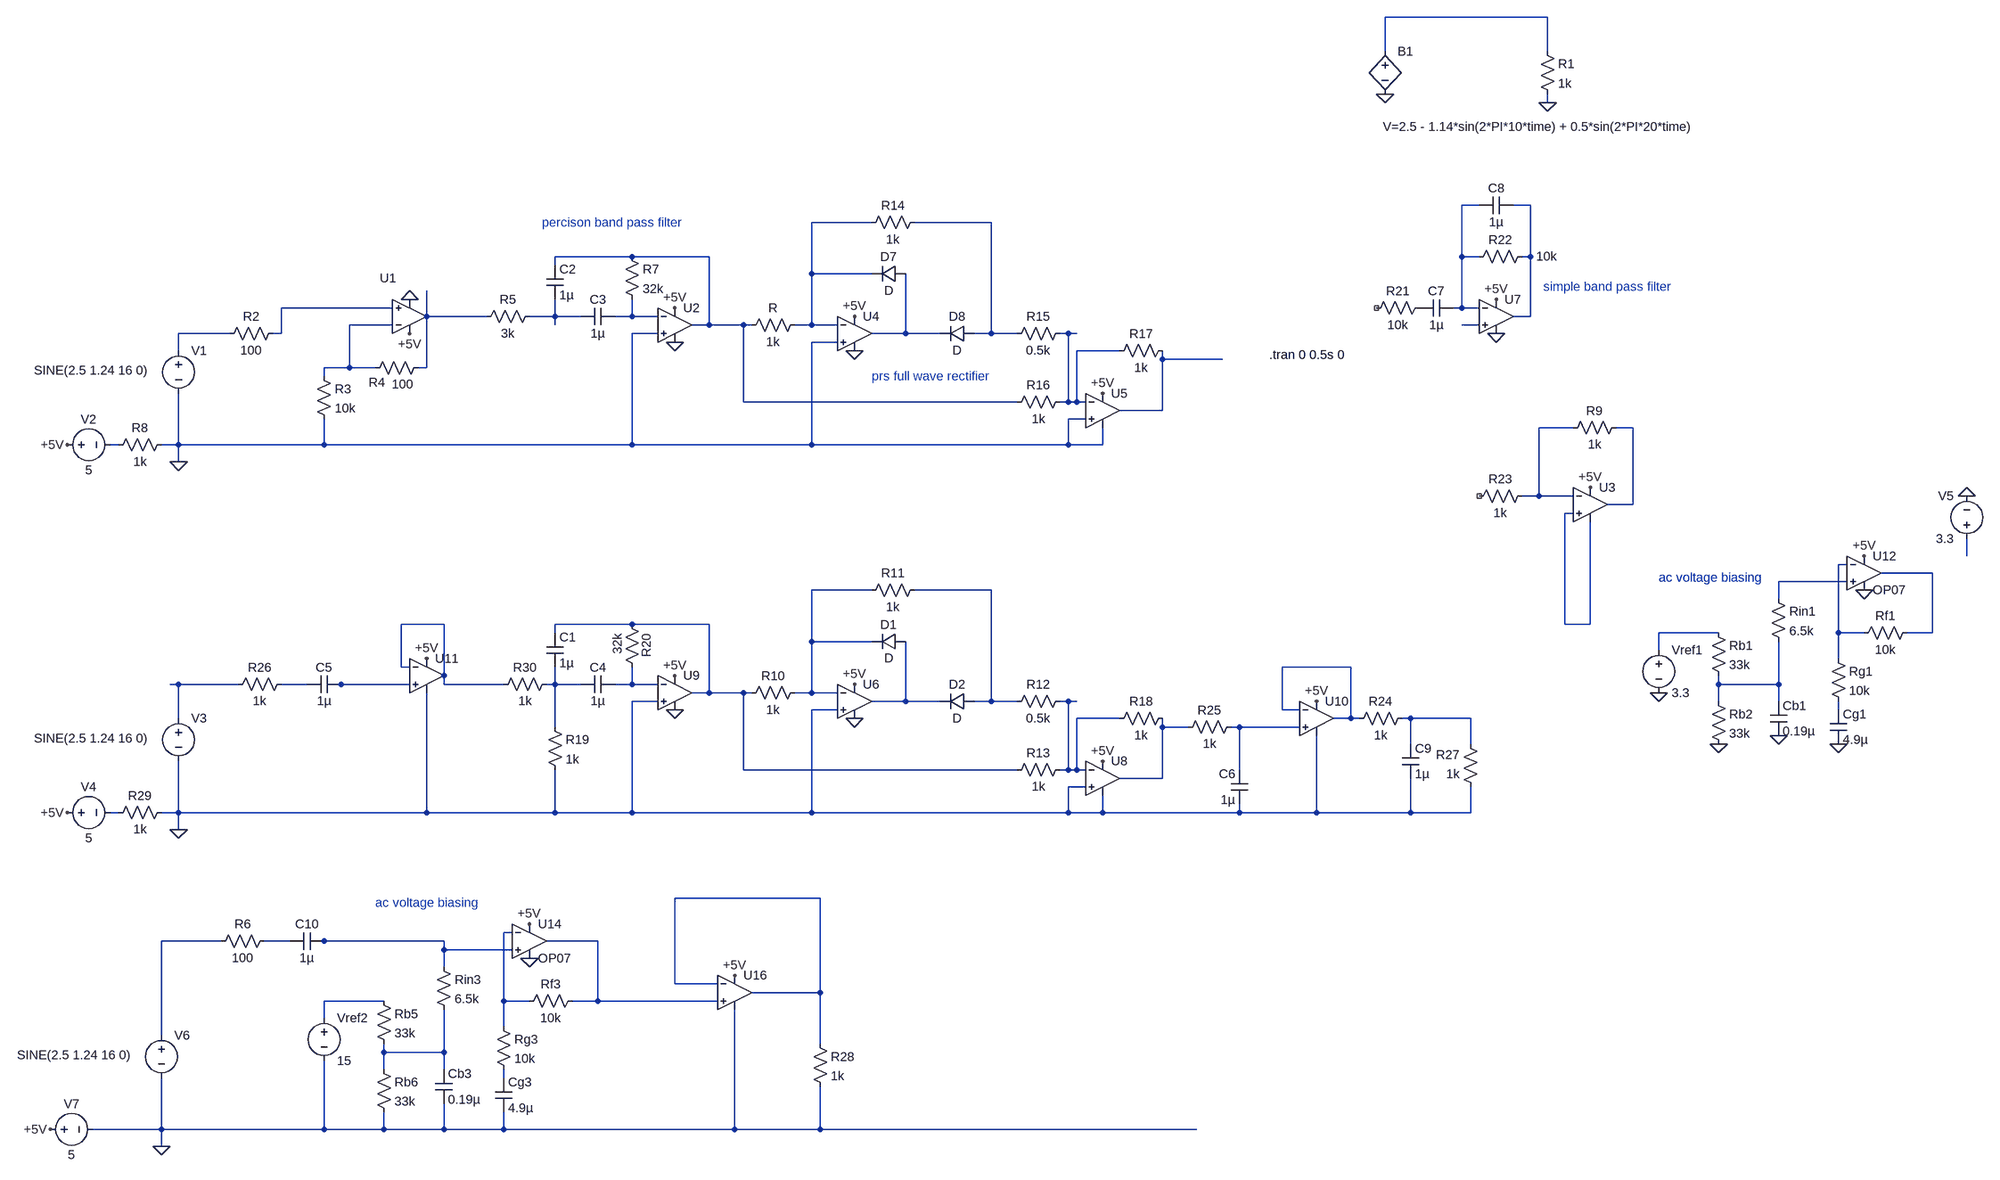
[diagram p0: schematic CO signal multiple systems.asc]
CO signal multiple systems.asc, the LTspice schematic file:
Version 4.1
SHEET 1 2020 3200
WIRE 1200 912 896 912
WIRE 896 976 896 912
WIRE 1200 976 1200 912
WIRE 1200 1072 1200 1056
WIRE 1072 1264 1040 1264
WIRE 1168 1264 1136 1264
WIRE -64 1296 -176 1296
WIRE 160 1296 16 1296
WIRE -512 1360 -656 1360
WIRE -368 1360 -512 1360
WIRE 1040 1360 1040 1264
WIRE 1072 1360 1040 1360
WIRE 1168 1360 1168 1264
WIRE 1168 1360 1152 1360
WIRE -656 1376 -656 1360
WIRE -176 1392 -176 1296
WIRE -64 1392 -176 1392
WIRE -960 1456 -1168 1456
WIRE 1040 1456 1040 1360
WIRE 1040 1456 1024 1456
WIRE 1072 1456 1040 1456
WIRE -896 1472 -896 1424
WIRE -784 1472 -896 1472
WIRE -656 1472 -656 1440
WIRE -656 1472 -704 1472
WIRE -608 1472 -656 1472
WIRE -512 1472 -512 1440
WIRE -512 1472 -544 1472
WIRE -464 1472 -512 1472
WIRE 1168 1472 1168 1360
WIRE 1168 1472 1136 1472
WIRE -960 1488 -1040 1488
WIRE -656 1488 -656 1472
WIRE -368 1488 -368 1360
WIRE -368 1488 -400 1488
WIRE -304 1488 -368 1488
WIRE -288 1488 -304 1488
WIRE -176 1488 -176 1392
WIRE -176 1488 -208 1488
WIRE -128 1488 -176 1488
WIRE 1072 1488 1040 1488
WIRE -1264 1504 -1360 1504
WIRE -1168 1504 -1168 1456
WIRE -1168 1504 -1184 1504
WIRE -464 1504 -512 1504
WIRE 0 1504 0 1392
WIRE 0 1504 -64 1504
WIRE 64 1504 0 1504
WIRE 160 1504 160 1296
WIRE 160 1504 128 1504
WIRE 208 1504 160 1504
WIRE 304 1504 288 1504
WIRE 320 1504 304 1504
WIRE -128 1520 -176 1520
WIRE -1360 1536 -1360 1504
WIRE 400 1536 320 1536
WIRE 480 1552 480 1536
WIRE 592 1552 480 1552
WIRE -1040 1568 -1040 1488
WIRE -1040 1568 -1088 1568
WIRE -992 1568 -1040 1568
WIRE -896 1568 -896 1472
WIRE -896 1568 -912 1568
WIRE -1088 1584 -1088 1568
WIRE -304 1632 -304 1488
WIRE 208 1632 -304 1632
WIRE 304 1632 304 1504
WIRE 304 1632 288 1632
WIRE 320 1632 320 1536
WIRE 320 1632 304 1632
WIRE 336 1632 320 1632
WIRE 480 1648 480 1552
WIRE 480 1648 400 1648
WIRE 336 1664 304 1664
WIRE 1248 1680 1184 1680
WIRE 1360 1680 1328 1680
WIRE -1472 1712 -1488 1712
WIRE -1360 1712 -1360 1616
WIRE -1360 1712 -1392 1712
WIRE -1088 1712 -1088 1664
WIRE -1088 1712 -1360 1712
WIRE -512 1712 -512 1504
WIRE -512 1712 -1088 1712
WIRE -176 1712 -176 1520
WIRE -176 1712 -512 1712
WIRE 304 1712 304 1664
WIRE 304 1712 -176 1712
WIRE 368 1712 368 1680
WIRE 368 1712 304 1712
WIRE -1360 1744 -1360 1712
WIRE 1184 1808 1184 1680
WIRE 1184 1808 1152 1808
WIRE 1248 1808 1184 1808
WIRE 1360 1824 1360 1680
WIRE 1360 1824 1312 1824
WIRE 1248 1840 1232 1840
WIRE 1984 1920 1984 1888
WIRE 1760 1936 1744 1936
WIRE 1920 1952 1824 1952
WIRE 1760 1968 1632 1968
WIRE -64 1984 -176 1984
WIRE 160 1984 16 1984
WIRE 1632 2000 1632 1968
WIRE -864 2048 -944 2048
WIRE -512 2048 -656 2048
WIRE -368 2048 -512 2048
WIRE 1232 2048 1232 1840
WIRE 1280 2048 1280 1856
WIRE 1280 2048 1232 2048
WIRE -656 2064 -656 2048
WIRE 1520 2064 1408 2064
WIRE 1744 2064 1744 1936
WIRE 1792 2064 1744 2064
WIRE 1920 2064 1920 1952
WIRE 1920 2064 1872 2064
WIRE -176 2080 -176 1984
WIRE -64 2080 -176 2080
WIRE 1408 2096 1408 2064
WIRE 1744 2112 1744 2064
WIRE -944 2128 -944 2048
WIRE -928 2128 -944 2128
WIRE 832 2128 704 2128
WIRE -864 2144 -864 2048
WIRE -1360 2160 -1376 2160
WIRE -1248 2160 -1360 2160
WIRE -1120 2160 -1168 2160
WIRE -1056 2160 -1072 2160
WIRE -928 2160 -1056 2160
WIRE -864 2160 -864 2144
WIRE -752 2160 -864 2160
WIRE -656 2160 -656 2128
WIRE -656 2160 -672 2160
WIRE -608 2160 -656 2160
WIRE -512 2160 -512 2128
WIRE -512 2160 -544 2160
WIRE -464 2160 -512 2160
WIRE 1520 2160 1520 2144
WIRE 1632 2160 1632 2080
WIRE 1632 2160 1520 2160
WIRE -368 2176 -368 2048
WIRE -368 2176 -400 2176
WIRE -304 2176 -368 2176
WIRE -288 2176 -304 2176
WIRE -176 2176 -176 2080
WIRE -176 2176 -208 2176
WIRE -128 2176 -176 2176
WIRE -464 2192 -512 2192
WIRE 0 2192 0 2080
WIRE 0 2192 -64 2192
WIRE 64 2192 0 2192
WIRE 160 2192 160 1984
WIRE 160 2192 128 2192
WIRE 208 2192 160 2192
WIRE 304 2192 288 2192
WIRE 320 2192 304 2192
WIRE 1520 2192 1520 2160
WIRE 1632 2192 1632 2160
WIRE -128 2208 -176 2208
WIRE 704 2208 704 2128
WIRE 736 2208 704 2208
WIRE 1744 2208 1744 2192
WIRE -1360 2224 -1360 2160
WIRE 400 2224 320 2224
WIRE 832 2224 832 2128
WIRE 832 2224 800 2224
WIRE 848 2224 832 2224
WIRE 944 2224 928 2224
WIRE 1056 2224 944 2224
WIRE -656 2240 -656 2160
WIRE 480 2240 480 2224
WIRE 528 2240 480 2240
WIRE 624 2240 608 2240
WIRE 736 2240 624 2240
WIRE 944 2272 944 2224
WIRE 1056 2272 1056 2224
WIRE -304 2320 -304 2176
WIRE 208 2320 -304 2320
WIRE 304 2320 304 2192
WIRE 304 2320 288 2320
WIRE 320 2320 320 2224
WIRE 320 2320 304 2320
WIRE 336 2320 320 2320
WIRE 624 2320 624 2240
WIRE 480 2336 480 2240
WIRE 480 2336 400 2336
WIRE 336 2352 304 2352
WIRE -1472 2400 -1488 2400
WIRE -1360 2400 -1360 2304
WIRE -1360 2400 -1392 2400
WIRE -896 2400 -896 2176
WIRE -896 2400 -1360 2400
WIRE -656 2400 -656 2320
WIRE -656 2400 -896 2400
WIRE -512 2400 -512 2192
WIRE -512 2400 -656 2400
WIRE -176 2400 -176 2208
WIRE -176 2400 -512 2400
WIRE 304 2400 304 2352
WIRE 304 2400 -176 2400
WIRE 368 2400 368 2368
WIRE 368 2400 304 2400
WIRE 624 2400 624 2384
WIRE 624 2400 368 2400
WIRE 768 2400 768 2256
WIRE 768 2400 624 2400
WIRE 944 2400 944 2336
WIRE 944 2400 768 2400
WIRE 1056 2400 1056 2352
WIRE 1056 2400 944 2400
WIRE -1360 2432 -1360 2400
WIRE -160 2704 -432 2704
WIRE -736 2768 -752 2768
WIRE -1280 2784 -1392 2784
WIRE -1152 2784 -1200 2784
WIRE -1088 2784 -1104 2784
WIRE -864 2784 -1088 2784
WIRE -576 2784 -672 2784
WIRE -864 2800 -864 2784
WIRE -736 2800 -864 2800
WIRE -864 2832 -864 2800
WIRE -432 2864 -432 2704
WIRE -352 2864 -432 2864
WIRE -160 2880 -160 2704
WIRE -160 2880 -288 2880
WIRE -976 2896 -1088 2896
WIRE -752 2896 -752 2768
WIRE -704 2896 -752 2896
WIRE -576 2896 -576 2784
WIRE -576 2896 -624 2896
WIRE -352 2896 -576 2896
WIRE -1088 2928 -1088 2896
WIRE -752 2944 -752 2896
WIRE -1392 2960 -1392 2784
WIRE -160 2976 -160 2880
WIRE -976 2992 -976 2976
WIRE -864 2992 -864 2912
WIRE -864 2992 -976 2992
WIRE -976 3024 -976 2992
WIRE -864 3024 -864 2992
WIRE -752 3040 -752 3024
WIRE -1392 3136 -1392 3040
WIRE -1392 3136 -1520 3136
WIRE -1088 3136 -1088 3008
WIRE -1088 3136 -1392 3136
WIRE -976 3136 -976 3104
WIRE -976 3136 -1088 3136
WIRE -864 3136 -864 3088
WIRE -864 3136 -976 3136
WIRE -752 3136 -752 3104
WIRE -752 3136 -864 3136
WIRE -320 3136 -320 2912
WIRE -320 3136 -752 3136
WIRE -160 3136 -160 3056
WIRE -160 3136 -320 3136
WIRE 544 3136 -160 3136
WIRE -1392 3168 -1392 3136
FLAG 1200 1072 0
FLAG 896 1056 0
FLAG -1360 1744 0
FLAG -1568 1712 +5V
FLAG -928 1504 +5V
FLAG -928 1440 0
FLAG 1104 1504 0
FLAG 1104 1440 +5V
FLAG -96 1472 +5V
FLAG -96 1536 0
FLAG 368 1616 +5V
FLAG -432 1456 +5V
FLAG -432 1520 0
FLAG -1360 2432 0
FLAG -1568 2400 +5V
FLAG -96 2160 +5V
FLAG -96 2224 0
FLAG 368 2304 +5V
FLAG -432 2144 +5V
FLAG -432 2208 0
FLAG 1280 1792 +5V
FLAG 768 2192 +5V
FLAG -896 2112 +5V
FLAG 1984 1808 0
FLAG -1392 3168 0
FLAG -1600 3136 +5V
FLAG 1792 1984 0
FLAG 1408 2176 0
FLAG 1520 2272 0
FLAG 1632 2256 0
FLAG 1744 2272 0
FLAG 1792 1920 +5V
FLAG -704 2816 0
FLAG -704 2752 +5V
FLAG -320 2848 +5V
SYMBOL bv 896 960 R0
WINDOW 3 -4 157 Left 2
SYMATTR Value V=2.5 - 1.14*sin(2*PI*10*time) + 0.5*sin(2*PI*20*time)
SYMATTR InstName B1
SYMBOL res 1184 960 R0
SYMATTR InstName R1
SYMATTR Value 1k
SYMBOL voltage -1360 1520 R0
WINDOW 3 -270 53 Left 2
WINDOW 123 0 0 Left 0
WINDOW 39 0 0 Left 0
SYMATTR Value SINE(2.5 1.24 16 0)
SYMATTR InstName V1
SYMBOL res -1168 1488 R90
WINDOW 0 0 56 VBottom 2
WINDOW 3 32 56 VTop 2
SYMATTR InstName R2
SYMATTR Value 100
SYMBOL res -1104 1568 R0
SYMATTR InstName R3
SYMATTR Value 10k
SYMBOL OpAmps\\UniversalOpAmp -928 1472 M180
WINDOW 0 -56 72 Left 2
SYMATTR InstName U1
SYMBOL voltage -1584 1712 R270
WINDOW 0 32 56 VTop 2
WINDOW 3 -32 56 VBottom 2
WINDOW 123 0 0 Left 0
WINDOW 39 0 0 Left 0
SYMATTR InstName V2
SYMATTR Value 5
SYMBOL res -896 1552 R90
WINDOW 0 59 93 VBottom 2
WINDOW 3 31 45 VTop 2
SYMATTR InstName R4
SYMATTR Value 100
SYMBOL res -192 1472 R90
WINDOW 0 0 56 VBottom 2
WINDOW 3 32 56 VTop 2
SYMATTR InstName R
SYMATTR Value 1k
SYMBOL OpAmps\\UniversalOpAmp -96 1504 R0
SYMATTR InstName U4
SYMBOL res 32 1280 R90
WINDOW 0 0 56 VBottom 2
WINDOW 3 32 56 VTop 2
SYMATTR InstName R14
SYMATTR Value 1k
SYMBOL diode 0 1376 R90
WINDOW 0 0 32 VBottom 2
WINDOW 3 32 32 VTop 2
SYMATTR InstName D7
SYMBOL diode 128 1488 R90
WINDOW 0 0 32 VBottom 2
WINDOW 3 32 32 VTop 2
SYMATTR InstName D8
SYMBOL res 304 1488 R90
WINDOW 0 0 56 VBottom 2
WINDOW 3 32 56 VTop 2
SYMATTR InstName R15
SYMATTR Value 0.5k
SYMBOL res 304 1616 R90
WINDOW 0 0 56 VBottom 2
WINDOW 3 32 56 VTop 2
SYMATTR InstName R16
SYMATTR Value 1k
SYMBOL OpAmps\\UniversalOpAmp 368 1648 R0
SYMATTR InstName U5
SYMBOL res 496 1520 R90
WINDOW 0 0 56 VBottom 2
WINDOW 3 32 56 VTop 2
SYMATTR InstName R17
SYMATTR Value 1k
SYMBOL res 976 1440 R90
WINDOW 0 0 56 VBottom 2
WINDOW 3 32 56 VTop 2
SYMATTR InstName R21
SYMATTR Value 10k
SYMBOL res 1168 1344 R90
WINDOW 0 0 56 VBottom 2
WINDOW 3 0 -30 VTop 2
SYMATTR InstName R22
SYMATTR Value 10k
SYMBOL cap 1024 1440 R90
WINDOW 0 0 32 VBottom 2
WINDOW 3 32 32 VTop 2
SYMATTR InstName C7
SYMATTR Value 1µ
SYMBOL cap 1136 1248 R90
WINDOW 0 0 32 VBottom 2
WINDOW 3 32 32 VTop 2
SYMATTR InstName C8
SYMATTR Value 1µ
SYMBOL OpAmps\\UniversalOpAmp 1104 1472 R0
SYMATTR InstName U7
SYMBOL res -688 1456 R90
WINDOW 0 0 56 VBottom 2
WINDOW 3 32 56 VTop 2
SYMATTR InstName R5
SYMATTR Value 3k
SYMBOL cap -672 1376 R0
SYMATTR InstName C2
SYMATTR Value 1µ
SYMBOL cap -544 1456 R90
WINDOW 0 0 32 VBottom 2
WINDOW 3 32 32 VTop 2
SYMATTR InstName C3
SYMATTR Value 1µ
SYMBOL res -528 1344 R0
SYMATTR InstName R7
SYMATTR Value 32k
SYMBOL OpAmps\\UniversalOpAmp -432 1488 R0
SYMATTR InstName U2
SYMBOL voltage -1360 2208 R0
WINDOW 3 -270 53 Left 2
WINDOW 123 0 0 Left 0
WINDOW 39 0 0 Left 0
SYMATTR Value SINE(2.5 1.24 16 0)
SYMATTR InstName V3
SYMBOL voltage -1584 2400 R270
WINDOW 0 32 56 VTop 2
WINDOW 3 -32 56 VBottom 2
WINDOW 123 0 0 Left 0
WINDOW 39 0 0 Left 0
SYMATTR InstName V4
SYMATTR Value 5
SYMBOL res -192 2160 R90
WINDOW 0 0 56 VBottom 2
WINDOW 3 32 56 VTop 2
SYMATTR InstName R10
SYMATTR Value 1k
SYMBOL OpAmps\\UniversalOpAmp -96 2192 R0
SYMATTR InstName U6
SYMBOL res 32 1968 R90
WINDOW 0 0 56 VBottom 2
WINDOW 3 32 56 VTop 2
SYMATTR InstName R11
SYMATTR Value 1k
SYMBOL diode 0 2064 R90
WINDOW 0 0 32 VBottom 2
WINDOW 3 32 32 VTop 2
SYMATTR InstName D1
SYMBOL diode 128 2176 R90
WINDOW 0 0 32 VBottom 2
WINDOW 3 32 32 VTop 2
SYMATTR InstName D2
SYMBOL res 304 2176 R90
WINDOW 0 0 56 VBottom 2
WINDOW 3 32 56 VTop 2
SYMATTR InstName R12
SYMATTR Value 0.5k
SYMBOL res 304 2304 R90
WINDOW 0 0 56 VBottom 2
WINDOW 3 32 56 VTop 2
SYMATTR InstName R13
SYMATTR Value 1k
SYMBOL OpAmps\\UniversalOpAmp 368 2336 R0
SYMATTR InstName U8
SYMBOL res 496 2208 R90
WINDOW 0 0 56 VBottom 2
WINDOW 3 32 56 VTop 2
SYMATTR InstName R18
SYMATTR Value 1k
SYMBOL res -656 2144 R90
WINDOW 0 0 56 VBottom 2
WINDOW 3 32 56 VTop 2
SYMATTR InstName R30
SYMATTR Value 1k
SYMBOL cap -672 2064 R0
SYMATTR InstName C1
SYMATTR Value 1µ
SYMBOL cap -544 2144 R90
WINDOW 0 0 32 VBottom 2
WINDOW 3 32 32 VTop 2
SYMATTR InstName C4
SYMATTR Value 1µ
SYMBOL res -528 2032 R0
WINDOW 0 43 33 VRight 2
WINDOW 3 -11 33 VRight 2
SYMATTR InstName R20
SYMATTR Value 32k
SYMBOL OpAmps\\UniversalOpAmp -432 2176 R0
SYMATTR InstName U9
SYMBOL cap -1056 2144 R90
WINDOW 0 0 32 VBottom 2
WINDOW 3 32 32 VTop 2
SYMATTR InstName C5
SYMATTR Value 1µ
SYMBOL OpAmps\\UniversalOpAmp 1280 1824 R0
SYMATTR InstName U3
SYMBOL res 1344 1664 R90
WINDOW 0 0 56 VBottom 2
WINDOW 3 32 56 VTop 2
SYMATTR InstName R9
SYMATTR Value 1k
SYMBOL res 1168 1792 R90
WINDOW 0 0 56 VBottom 2
WINDOW 3 32 56 VTop 2
SYMATTR InstName R23
SYMATTR Value 1k
SYMBOL res 512 2256 R270
WINDOW 0 32 56 VTop 2
WINDOW 3 0 56 VBottom 2
SYMATTR InstName R25
SYMATTR Value 1k
SYMBOL cap 640 2384 R180
WINDOW 0 24 56 Left 2
WINDOW 3 24 8 Left 2
SYMATTR InstName C6
SYMATTR Value 1µ
SYMBOL OpAmps\\UniversalOpAmp 768 2224 R0
SYMATTR InstName U10
SYMBOL res 944 2208 R90
WINDOW 0 0 56 VBottom 2
WINDOW 3 32 56 VTop 2
SYMATTR InstName R24
SYMATTR Value 1k
SYMBOL OpAmps\\UniversalOpAmp -896 2144 R0
SYMATTR InstName U11
SYMBOL res -1152 2144 R90
WINDOW 0 0 56 VBottom 2
WINDOW 3 32 56 VTop 2
SYMATTR InstName R26
SYMATTR Value 1k
SYMBOL res -1376 1696 R90
WINDOW 0 0 56 VBottom 2
WINDOW 3 32 56 VTop 2
SYMATTR InstName R8
SYMATTR Value 1k
SYMBOL OpAmps\\OP07 1792 1888 R0
SYMATTR InstName U12
SYMBOL res 1616 1984 R0
SYMATTR InstName Rin1
SYMATTR Value 6.5k
SYMBOL res 1504 2048 R0
SYMATTR InstName Rb1
SYMATTR Value 33k
SYMBOL res 1504 2176 R0
SYMATTR InstName Rb2
SYMATTR Value 33k
SYMBOL res 1728 2096 R0
SYMATTR InstName Rg1
SYMATTR Value 10k
SYMBOL res 1888 2048 R90
WINDOW 0 0 56 VBottom 2
WINDOW 3 32 56 VTop 2
SYMATTR InstName Rf1
SYMATTR Value 10k
SYMBOL cap 1616 2192 R0
SYMATTR InstName Cb1
SYMATTR Value 0.19µ
SYMBOL cap 1728 2208 R0
SYMATTR InstName Cg1
SYMATTR Value 4.9µ
SYMBOL voltage 1408 2080 R0
SYMATTR InstName Vref1
SYMATTR Value 3.3
SYMBOL voltage 1984 1904 R180
WINDOW 0 24 96 Left 2
WINDOW 3 24 16 Left 2
SYMATTR InstName V5
SYMATTR Value 3.3
SYMBOL res 1072 2368 R180
WINDOW 0 36 76 Left 2
WINDOW 3 36 40 Left 2
SYMATTR InstName R27
SYMATTR Value 1k
SYMBOL cap 928 2272 R0
SYMATTR InstName C9
SYMATTR Value 1µ
SYMBOL res -672 2224 R0
SYMATTR InstName R19
SYMATTR Value 1k
SYMBOL voltage -1392 2944 R0
WINDOW 3 -270 53 Left 2
WINDOW 123 0 0 Left 0
WINDOW 39 0 0 Left 0
SYMATTR Value SINE(2.5 1.24 16 0)
SYMATTR InstName V6
SYMBOL voltage -1616 3136 R270
WINDOW 0 32 56 VTop 2
WINDOW 3 -32 56 VBottom 2
WINDOW 123 0 0 Left 0
WINDOW 39 0 0 Left 0
SYMATTR InstName V7
SYMATTR Value 5
SYMBOL cap -1088 2768 R90
WINDOW 0 0 32 VBottom 2
WINDOW 3 32 32 VTop 2
SYMATTR InstName C10
SYMATTR Value 1µ
SYMBOL res -1184 2768 R90
WINDOW 0 0 56 VBottom 2
WINDOW 3 32 56 VTop 2
SYMATTR InstName R6
SYMATTR Value 100
SYMBOL OpAmps\\OP07 -704 2720 R0
SYMATTR InstName U14
SYMBOL res -880 2816 R0
SYMATTR InstName Rin3
SYMATTR Value 6.5k
SYMBOL res -992 2880 R0
SYMATTR InstName Rb5
SYMATTR Value 33k
SYMBOL res -992 3008 R0
SYMATTR InstName Rb6
SYMATTR Value 33k
SYMBOL res -768 2928 R0
SYMATTR InstName Rg3
SYMATTR Value 10k
SYMBOL res -608 2880 R90
WINDOW 0 0 56 VBottom 2
WINDOW 3 32 56 VTop 2
SYMATTR InstName Rf3
SYMATTR Value 10k
SYMBOL cap -880 3024 R0
SYMATTR InstName Cb3
SYMATTR Value 0.19µ
SYMBOL cap -768 3040 R0
SYMATTR InstName Cg3
SYMATTR Value 4.9µ
SYMBOL voltage -1088 2912 R0
WINDOW 123 0 0 Left 0
WINDOW 39 0 0 Left 0
SYMATTR InstName Vref2
SYMATTR Value 15
SYMBOL OpAmps\\UniversalOpAmp -320 2880 R0
SYMATTR InstName U16
SYMBOL res -176 2960 R0
SYMATTR InstName R28
SYMATTR Value 1k
SYMBOL res -1376 2384 R90
WINDOW 0 0 56 VBottom 2
WINDOW 3 32 56 VTop 2
SYMATTR InstName R29
SYMATTR Value 1k
TEXT 680 1544 Left 2 !.tran 0 0.5s 0
TEXT -680 1296 Left 2 ;percison band pass filter
TEXT 1192 1416 Left 2 ;simple band pass filter
TEXT -64 1584 Left 2 ;prs full wave rectifier
TEXT 1408 1960 Left 2 ;ac voltage biasing
TEXT 1408 1960 Left 2 ;ac voltage biasing
TEXT -992 2712 Left 2 ;ac voltage biasing

The netlist it stands for:
* CO signal multiple systems.asc
B1 N001 0 V=2.5 - 1.14*sin(2*PI*10*time) + 0.5*sin(2*PI*20*time)
R1 N001 0 1k
V1 N013 0 SINE(2.5 1.24 16 0)
R2 N007 N013 100
R3 N011 0 10k
X§U1 N007 N011 +5V 0 N008 level1 Avol=1Meg GBW=10Meg Vos=0 En=0 Enk=0 In=0 Ink=0 Rin=500Meg  ; pins In+ In- V+ V- OUT
V2 +5V N019 5
R4 N008 N011 100
R N004 N006 1k
X§U4 0 N004 +5V 0 N014 level1 Avol=1Meg GBW=10Meg Vos=0 En=0 Enk=0 In=0 Ink=0 Rin=500Meg  ; pins In+ In- V+ V- OUT
R14 N005 N004 1k
D7 N014 N004 D
D8 N005 N014 D
R15 N015 N005 0.5k
R16 N015 N006 1k
X§U5 0 N015 +5V 0 N016 level1 Avol=1Meg GBW=10Meg Vos=0 En=0 Enk=0 In=0 Ink=0 Rin=500Meg  ; pins In+ In- V+ V- OUT
R17 N016 N015 1k
R21 P001 NC_01 10k
R22 N003 N002 10k
C7 N002 P001 1µ
C8 N003 N002 1µ
X§U7 N012 N002 +5V 0 N003 level1 Avol=1Meg GBW=10Meg Vos=0 En=0 Enk=0 In=0 Ink=0 Rin=500Meg  ; pins In+ In- V+ V- OUT
R5 N009 N008 3k
C2 N006 N009 1µ
C3 N010 N009 1µ
R7 N006 N010 32k
X§U2 0 N010 +5V 0 N006 level1 Avol=1Meg GBW=10Meg Vos=0 En=0 Enk=0 In=0 Ink=0 Rin=500Meg  ; pins In+ In- V+ V- OUT
V3 N031 0 SINE(2.5 1.24 16 0)
V4 +5V N043 5
R10 N025 N028 1k
X§U6 0 N025 +5V 0 N037 level1 Avol=1Meg GBW=10Meg Vos=0 En=0 Enk=0 In=0 Ink=0 Rin=500Meg  ; pins In+ In- V+ V- OUT
R11 N026 N025 1k
D1 N037 N025 D
D2 N026 N037 D
R12 N038 N026 0.5k
R13 N038 N028 1k
X§U8 0 N038 +5V 0 N041 level1 Avol=1Meg GBW=10Meg Vos=0 En=0 Enk=0 In=0 Ink=0 Rin=500Meg  ; pins In+ In- V+ V- OUT
R18 N041 N038 1k
R30 N034 N027 1k
C1 N028 N034 1µ
C4 N035 N034 1µ
R20 N028 N035 32k
X§U9 0 N035 +5V 0 N028 level1 Avol=1Meg GBW=10Meg Vos=0 En=0 Enk=0 In=0 Ink=0 Rin=500Meg  ; pins In+ In- V+ V- OUT
C5 N033 N032 1µ
X§U3 N020 N017 +5V N020 N018 level1 Avol=1Meg GBW=10Meg Vos=0 En=0 Enk=0 In=0 Ink=0 Rin=500Meg  ; pins In+ In- V+ V- OUT
R9 N018 N017 1k
R23 N017 NC_02 1k
R25 N041 N042 1k
C6 0 N042 1µ
X§U10 N042 N030 +5V 0 N030 level1 Avol=1Meg GBW=10Meg Vos=0 En=0 Enk=0 In=0 Ink=0 Rin=500Meg  ; pins In+ In- V+ V- OUT
R24 N040 N030 1k
X§U11 N033 N027 +5V 0 N027 level1 Avol=1Meg GBW=10Meg Vos=0 En=0 Enk=0 In=0 Ink=0 Rin=500Meg  ; pins In+ In- V+ V- OUT
R26 N032 N031 1k
R8 0 N019 1k
X§U12 N024 N022 +5V 0 N023 LT1001  ; OP07, pins In+ In- V+ V- OUT
Rin1 N024 N036 6.5k
Rb1 N029 N036 33k
Rb2 N036 0 33k
Rg1 N022 N039 10k
Rf1 N023 N022 10k
Cb1 N036 0 0.19µ
Cg1 N039 0 4.9µ
Vref1 N029 0 3.3
V5 N021 0 3.3
R27 0 N040 1k
C9 N040 0 1µ
R19 N034 0 1k
V6 N046 0 SINE(2.5 1.24 16 0)
V7 +5V 0 5
C10 N048 N047 1µ
R6 N047 N046 100
X§U14 N048 N045 +5V 0 N049 LT1001  ; OP07, pins In+ In- V+ V- OUT
Rin3 N048 N051 6.5k
Rb5 N050 N051 33k
Rb6 N051 0 33k
Rg3 N045 N052 10k
Rf3 N049 N045 10k
Cb3 N051 0 0.19µ
Cg3 N052 0 4.9µ
Vref2 N050 0 15
X§U16 N049 N044 +5V 0 N044 level1 Avol=1Meg GBW=10Meg Vos=0 En=0 Enk=0 In=0 Ink=0 Rin=500Meg  ; pins In+ In- V+ V- OUT
R28 N044 0 1k
R29 0 N043 1k
.model D D
.lib standard.dio
.tran 0 0.5s 0
* percison band pass filter
* simple band pass filter
* prs full wave rectifier
* ac voltage biasing
* ac voltage biasing
* ac voltage biasing
.lib UniversalOpAmp1.lib
.lib LTC.lib
.backanno
.end